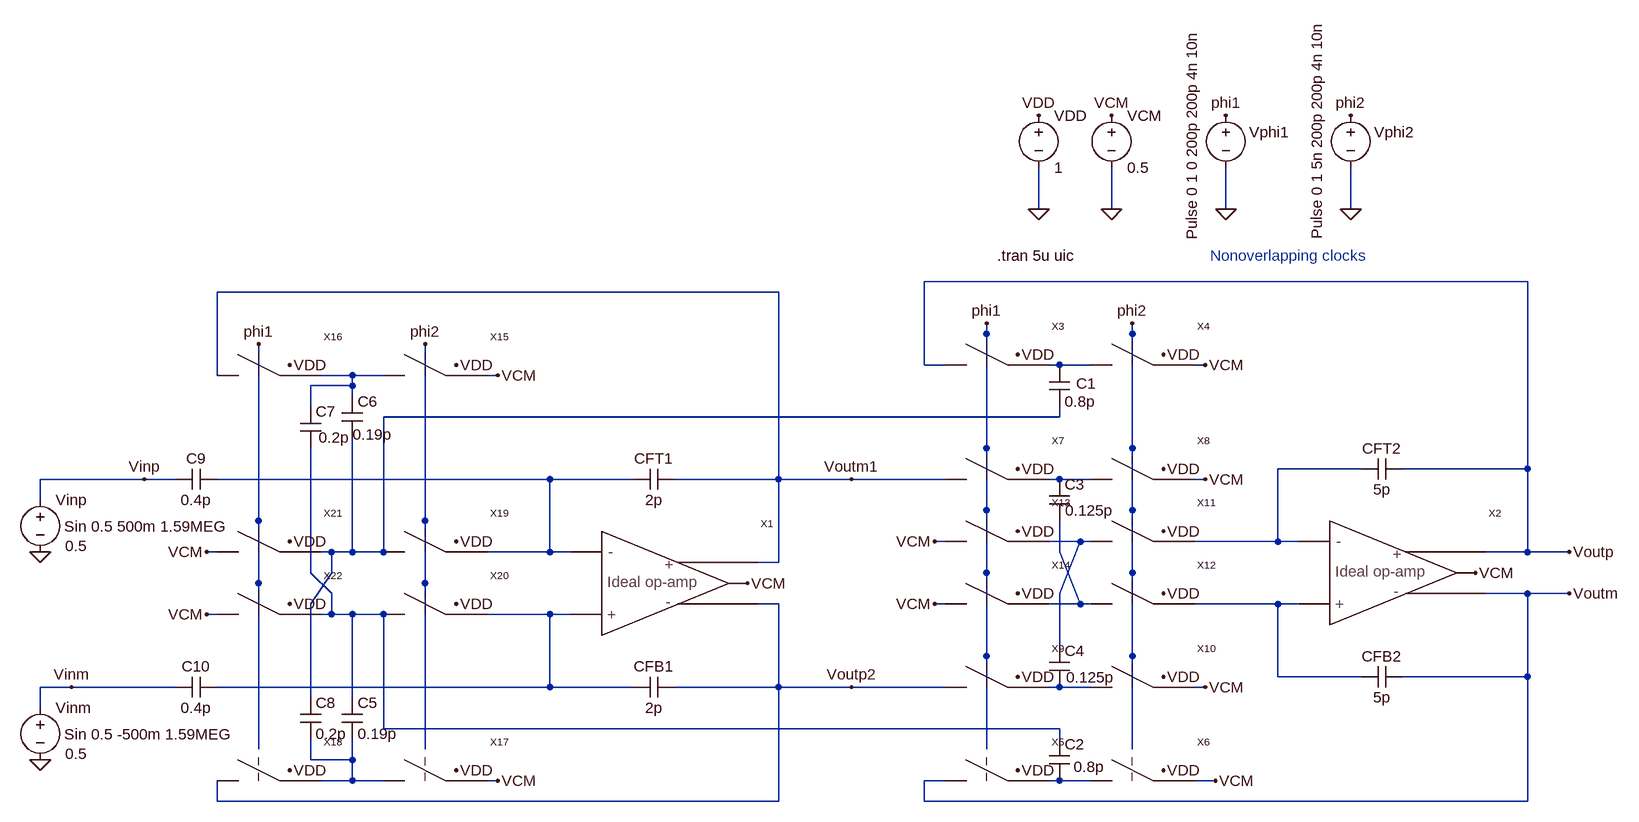
[diagram p0: schematic _Fig3_48_MSD.asc]
_Fig3_48_MSD.asc, the LTspice schematic file:
Version 4
SHEET 1 2784 704
WIRE 1872 -976 1872 -1040
WIRE 1984 -976 1984 -1040
WIRE 2160 -976 2160 -1040
WIRE 2352 -976 2352 -1040
WIRE 2624 -864 1696 -864
WIRE 1472 -848 608 -848
WIRE 1792 -784 1792 -800
WIRE 2016 -784 2016 -800
WIRE 1696 -736 1696 -864
WIRE 1728 -736 1696 -736
WIRE 1904 -736 1888 -736
WIRE 1952 -736 1904 -736
WIRE 2128 -736 2112 -736
WIRE 608 -720 608 -848
WIRE 816 -720 768 -720
WIRE 864 -720 816 -720
WIRE 1040 -720 1024 -720
WIRE 816 -704 816 -720
WIRE 816 -704 752 -704
WIRE 816 -688 816 -704
WIRE 752 -672 752 -704
WIRE 1904 -656 1904 -672
WIRE 1904 -656 864 -656
WIRE 1792 -608 1792 -784
WIRE 2016 -608 2016 -784
WIRE 2368 -576 2240 -576
WIRE 2624 -576 2624 -864
WIRE 2624 -576 2432 -576
WIRE 496 -560 336 -560
WIRE 544 -560 496 -560
WIRE 1120 -560 608 -560
WIRE 1248 -560 1120 -560
WIRE 1472 -560 1472 -848
WIRE 1472 -560 1312 -560
WIRE 1584 -560 1472 -560
WIRE 1728 -560 1584 -560
WIRE 1904 -560 1888 -560
WIRE 1952 -560 1904 -560
WIRE 2128 -560 2112 -560
WIRE 336 -528 336 -560
WIRE 1792 -512 1792 -608
WIRE 2016 -512 2016 -608
WIRE 672 -496 672 -768
WIRE 928 -496 928 -768
WIRE 1728 -464 1712 -464
WIRE 1936 -464 1888 -464
WIRE 1952 -464 1936 -464
WIRE 2240 -464 2240 -576
WIRE 2240 -464 2112 -464
WIRE 2272 -464 2240 -464
WIRE 608 -448 592 -448
WIRE 784 -448 768 -448
WIRE 816 -448 816 -624
WIRE 816 -448 784 -448
WIRE 864 -448 864 -656
WIRE 864 -448 816 -448
WIRE 1120 -448 1120 -560
WIRE 1120 -448 1024 -448
WIRE 1152 -448 1120 -448
WIRE 1904 -448 1904 -496
WIRE 2624 -448 2624 -576
WIRE 2624 -448 2560 -448
WIRE 2688 -448 2624 -448
WIRE 1472 -432 1472 -560
WIRE 1472 -432 1440 -432
WIRE 752 -416 752 -608
WIRE 784 -416 784 -448
WIRE 1792 -416 1792 -512
WIRE 2016 -416 2016 -512
WIRE 672 -400 672 -496
WIRE 928 -400 928 -496
WIRE 784 -384 752 -416
WIRE 1904 -384 1936 -464
WIRE 2624 -384 2560 -384
WIRE 2688 -384 2624 -384
WIRE 752 -368 784 -416
WIRE 1472 -368 1440 -368
WIRE 1728 -368 1712 -368
WIRE 1936 -368 1904 -448
WIRE 1936 -368 1888 -368
WIRE 1952 -368 1936 -368
WIRE 2240 -368 2112 -368
WIRE 2272 -368 2240 -368
WIRE 608 -352 592 -352
WIRE 784 -352 784 -384
WIRE 784 -352 768 -352
WIRE 816 -352 784 -352
WIRE 864 -352 816 -352
WIRE 1120 -352 1024 -352
WIRE 1152 -352 1120 -352
WIRE 1904 -304 1904 -384
WIRE 1792 -288 1792 -416
WIRE 2016 -288 2016 -416
WIRE 2240 -256 2240 -368
WIRE 2368 -256 2240 -256
WIRE 2624 -256 2624 -384
WIRE 2624 -256 2432 -256
WIRE 384 -240 336 -240
WIRE 544 -240 384 -240
WIRE 1120 -240 1120 -352
WIRE 1120 -240 608 -240
WIRE 1248 -240 1120 -240
WIRE 1472 -240 1472 -368
WIRE 1472 -240 1312 -240
WIRE 1584 -240 1472 -240
WIRE 1728 -240 1584 -240
WIRE 1904 -240 1888 -240
WIRE 1952 -240 1904 -240
WIRE 2128 -240 2112 -240
WIRE 752 -224 752 -368
WIRE 816 -224 816 -352
WIRE 336 -208 336 -240
WIRE 864 -176 864 -352
WIRE 1904 -176 864 -176
WIRE 1904 -160 1904 -176
WIRE 672 -144 672 -400
WIRE 928 -144 928 -400
WIRE 1792 -144 1792 -288
WIRE 2016 -144 2016 -288
WIRE 752 -128 752 -160
WIRE 816 -128 816 -160
WIRE 816 -128 752 -128
WIRE 816 -96 816 -128
WIRE 816 -96 768 -96
WIRE 864 -96 816 -96
WIRE 1040 -96 1024 -96
WIRE 1728 -96 1696 -96
WIRE 1904 -96 1888 -96
WIRE 1952 -96 1904 -96
WIRE 2144 -96 2112 -96
WIRE 608 -64 608 -96
WIRE 1472 -64 1472 -240
WIRE 1472 -64 608 -64
WIRE 1696 -64 1696 -96
WIRE 2624 -64 2624 -256
WIRE 2624 -64 1696 -64
FLAG 1424 -400 VCM
FLAG 1584 -560 Voutm1
FLAG 1584 -240 Voutp2
FLAG 336 -448 0
FLAG 496 -560 Vinp
FLAG 384 -240 Vinm
FLAG 336 -128 0
FLAG 2544 -416 VCM
FLAG 2688 -448 Voutp
FLAG 2688 -384 Voutm
FLAG 2160 -976 0
FLAG 2160 -1120 phi1
FLAG 1872 -976 0
FLAG 1872 -1120 VDD
FLAG 2352 -976 0
FLAG 2352 -1120 phi2
FLAG 1984 -976 0
FLAG 1984 -1120 VCM
FLAG 1792 -800 phi1
FLAG 1840 -752 VDD
FLAG 2064 -752 VDD
FLAG 2064 -112 VDD
FLAG 1840 -112 VDD
FLAG 2016 -800 phi2
FLAG 2128 -736 VCM
FLAG 2144 -96 VCM
FLAG 1840 -576 VDD
FLAG 2064 -576 VDD
FLAG 2128 -560 VCM
FLAG 1840 -256 VDD
FLAG 2064 -256 VDD
FLAG 2128 -240 VCM
FLAG 2064 -480 VDD
FLAG 2064 -384 VDD
FLAG 1840 -480 VDD
FLAG 1840 -384 VDD
FLAG 1712 -464 VCM
FLAG 1712 -368 VCM
FLAG 976 -736 VDD
FLAG 720 -736 VDD
FLAG 720 -112 VDD
FLAG 976 -112 VDD
FLAG 672 -768 phi1
FLAG 928 -768 phi2
FLAG 1040 -96 VCM
FLAG 1040 -720 VCM
FLAG 976 -464 VDD
FLAG 976 -368 VDD
FLAG 720 -464 VDD
FLAG 720 -368 VDD
FLAG 592 -448 VCM
FLAG 592 -352 VCM
SYMBOL Ideal_differential_op_amp 1200 -400 R0
SYMATTR InstName X1
SYMBOL cap 1312 -576 R90
WINDOW 0 0 32 VBottom 0
WINDOW 3 32 32 VTop 0
SYMATTR InstName CFT1
SYMATTR Value 2p
SYMBOL cap 1312 -256 R90
WINDOW 0 0 32 VBottom 0
WINDOW 3 32 32 VTop 0
SYMATTR InstName CFB1
SYMATTR Value 2p
SYMBOL voltage 336 -544 R0
WINDOW 3 38 87 Left 0
WINDOW 123 37 57 Left 0
WINDOW 39 0 0 Left 0
SYMATTR Value 0.5
SYMATTR Value2 Sin 0.5 500m 1.59MEG
SYMATTR InstName Vinp
SYMBOL voltage 336 -224 R0
WINDOW 3 38 87 Left 0
WINDOW 123 37 57 Left 0
WINDOW 39 0 0 Left 0
SYMATTR Value 0.5
SYMATTR Value2 Sin 0.5 -500m 1.59MEG
SYMATTR InstName Vinm
SYMBOL Ideal_differential_op_amp 2320 -416 R0
SYMATTR InstName X2
SYMBOL cap 2432 -592 R90
WINDOW 0 0 32 VBottom 0
WINDOW 3 32 32 VTop 0
SYMATTR InstName CFT2
SYMATTR Value 5p
SYMBOL cap 2432 -272 R90
WINDOW 0 0 32 VBottom 0
WINDOW 3 32 32 VTop 0
SYMATTR InstName CFB2
SYMATTR Value 5p
SYMBOL voltage 2160 -1136 R0
WINDOW 0 36 42 Left 0
WINDOW 3 -52 207 VLeft 0
WINDOW 123 0 0 Left 0
WINDOW 39 0 0 Left 0
SYMATTR InstName Vphi1
SYMATTR Value Pulse 0 1 0 200p 200p 4n 10n
SYMBOL voltage 1872 -1136 R0
WINDOW 123 0 0 Left 0
WINDOW 39 0 0 Left 0
SYMATTR InstName VDD
SYMATTR Value 1
SYMBOL voltage 2352 -1136 R0
WINDOW 0 36 42 Left 0
WINDOW 3 -52 207 VLeft 0
WINDOW 123 0 0 Left 0
WINDOW 39 0 0 Left 0
SYMATTR InstName Vphi2
SYMATTR Value Pulse 0 1 5n 200p 200p 4n 10n
SYMBOL voltage 1984 -1136 R0
WINDOW 123 0 0 Left 0
WINDOW 39 0 0 Left 0
SYMATTR InstName VCM
SYMATTR Value 0.5
SYMBOL switch_1 1728 -720 R0
SYMATTR InstName X3
SYMBOL switch_1 1952 -720 R0
SYMATTR InstName X4
SYMBOL switch_1 1728 -80 R0
SYMATTR InstName X5
SYMBOL switch_1 1952 -80 R0
SYMATTR InstName X6
SYMBOL cap 1888 -736 R0
WINDOW 0 42 29 Left 0
SYMATTR InstName C1
SYMATTR Value 0.8p
SYMBOL cap 1888 -160 R0
WINDOW 3 38 43 Left 0
SYMATTR Value 0.8p
SYMATTR InstName C2
SYMBOL switch_1 1728 -544 R0
SYMATTR InstName X7
SYMBOL switch_1 1952 -544 R0
SYMATTR InstName X8
SYMBOL switch_1 1728 -224 R0
SYMATTR InstName X9
SYMBOL switch_1 1952 -224 R0
SYMATTR InstName X10
SYMBOL cap 1888 -560 R0
WINDOW 3 25 48 Left 0
SYMATTR Value 0.125p
SYMATTR InstName C3
SYMBOL cap 1888 -304 R0
WINDOW 3 26 49 Left 0
SYMATTR Value 0.125p
SYMATTR InstName C4
SYMBOL switch_1 1952 -448 R0
SYMATTR InstName X11
SYMBOL switch_1 1952 -352 R0
SYMATTR InstName X12
SYMBOL switch_1 1728 -448 R0
SYMATTR InstName X13
SYMBOL switch_1 1728 -352 R0
SYMATTR InstName X14
SYMBOL switch_1 864 -704 R0
SYMATTR InstName X15
SYMBOL switch_1 608 -704 R0
SYMATTR InstName X16
SYMBOL switch_1 864 -80 R0
SYMATTR InstName X17
SYMBOL switch_1 608 -80 R0
SYMATTR InstName X18
SYMBOL switch_1 864 -432 R0
SYMATTR InstName X19
SYMBOL switch_1 864 -336 R0
SYMATTR InstName X20
SYMBOL switch_1 608 -432 R0
SYMATTR InstName X21
SYMBOL switch_1 608 -336 R0
SYMATTR InstName X22
SYMBOL cap 800 -224 R0
SYMATTR InstName C5
SYMATTR Value 0.19p
SYMBOL cap 800 -688 R0
WINDOW 3 17 59 Left 0
SYMATTR Value 0.19p
SYMATTR InstName C6
SYMBOL cap 736 -672 R0
WINDOW 3 28 48 Left 0
SYMATTR Value 0.2p
SYMATTR InstName C7
SYMBOL cap 736 -224 R0
SYMATTR InstName C8
SYMATTR Value 0.2p
SYMBOL cap 608 -576 R90
WINDOW 0 0 32 VBottom 0
WINDOW 3 32 32 VTop 0
SYMATTR InstName C9
SYMATTR Value 0.4p
SYMBOL cap 608 -256 R90
WINDOW 0 0 32 VBottom 0
WINDOW 3 32 32 VTop 0
SYMATTR InstName C10
SYMATTR Value 0.4p
TEXT 1808 -904 Left 0 !.tran 5u uic
TEXT 2136 -904 Left 0 ;Nonoverlapping clocks

The netlist it stands for:
* _Fig3_48_MSD.asc
XX1 N005 N011 Voutm1 VCM Voutp2 Ideal_differential_op_amp  ; pins Vinm Vinp Outp VCM Outm
CFT1 Voutm1 N005 2p
CFB1 Voutp2 N011 2p
Vinp Vinp 0 0.5 Sin 0.5 500m 1.59MEG
Vinm Vinm 0 0.5 Sin 0.5 -500m 1.59MEG
XX2 N004 N010 Voutp VCM Voutm Ideal_differential_op_amp  ; pins Vinm Vinp Outp VCM Outm
CFT2 Voutp N004 5p
CFB2 Voutm N010 5p
Vphi1 phi1 0 Pulse 0 1 0 200p 200p 4n 10n
VDD VDD 0 1
Vphi2 phi2 0 Pulse 0 1 5n 200p 200p 4n 10n
VCM VCM 0 0.5
XX3 Voutp N001 phi1 VDD switch_1  ; pins P1 P2 clk VDD
XX4 N001 VCM phi2 VDD switch_1  ; pins P1 P2 clk VDD
XX5 Voutm N014 phi1 VDD switch_1  ; pins P1 P2 clk VDD
XX6 N014 VCM phi2 VDD switch_1  ; pins P1 P2 clk VDD
C1 N001 N003 0.8p
C2 N009 N014 0.8p
XX7 Voutm1 N006 phi1 VDD switch_1  ; pins P1 P2 clk VDD
XX8 N006 VCM phi2 VDD switch_1  ; pins P1 P2 clk VDD
XX9 Voutp2 N012 phi1 VDD switch_1  ; pins P1 P2 clk VDD
XX10 N012 VCM phi2 VDD switch_1  ; pins P1 P2 clk VDD
C3 N006 N008 0.125p
C4 N007 N012 0.125p
XX11 N007 N004 phi2 VDD switch_1  ; pins P1 P2 clk VDD
XX12 N008 N010 phi2 VDD switch_1  ; pins P1 P2 clk VDD
XX13 VCM N007 phi1 VDD switch_1  ; pins P1 P2 clk VDD
XX14 VCM N008 phi1 VDD switch_1  ; pins P1 P2 clk VDD
XX15 N002 VCM phi2 VDD switch_1  ; pins P1 P2 clk VDD
XX16 Voutm1 N002 phi1 VDD switch_1  ; pins P1 P2 clk VDD
XX17 N013 VCM phi2 VDD switch_1  ; pins P1 P2 clk VDD
XX18 Voutp2 N013 phi1 VDD switch_1  ; pins P1 P2 clk VDD
XX19 N003 N005 phi2 VDD switch_1  ; pins P1 P2 clk VDD
XX20 N009 N011 phi2 VDD switch_1  ; pins P1 P2 clk VDD
XX21 VCM N003 phi1 VDD switch_1  ; pins P1 P2 clk VDD
XX22 VCM N009 phi1 VDD switch_1  ; pins P1 P2 clk VDD
C5 N009 N013 0.19p
C6 N002 N003 0.19p
C7 N002 N009 0.2p
C8 N003 N013 0.2p
C9 N005 Vinp 0.4p
C10 N011 Vinm 0.4p
.tran 5u uic
* Nonoverlapping clocks
.backanno
.end